# Altium schematic sheet placaTemporizadora.SchDoc
size A4
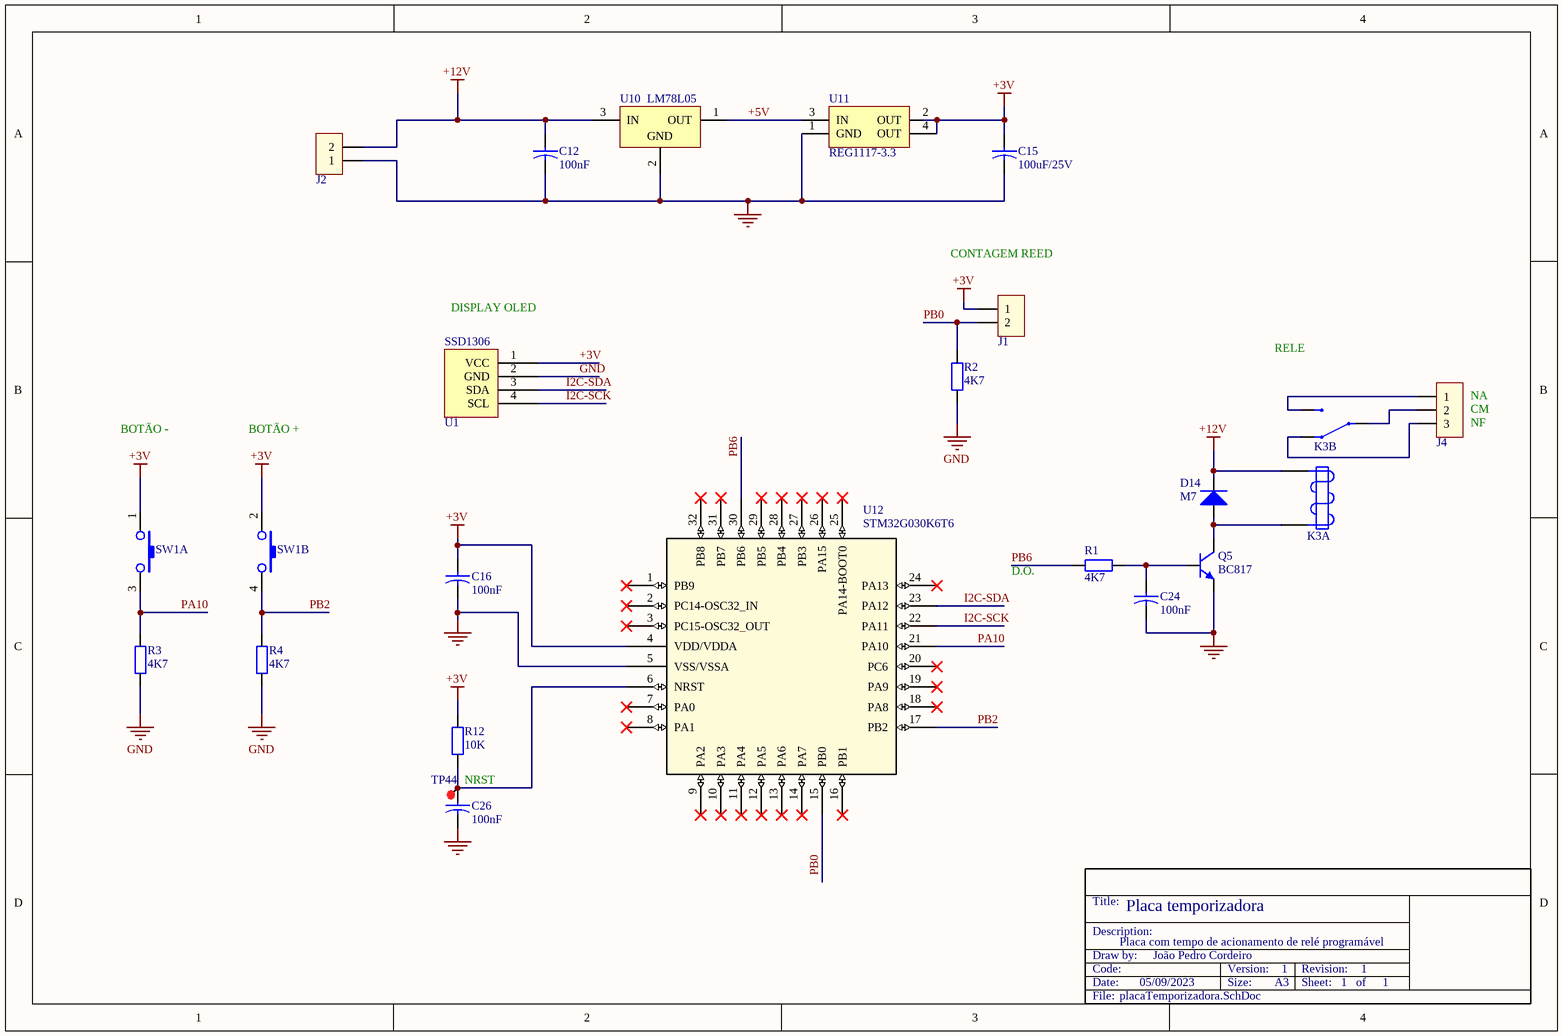
[diagram p0: placaTemporizadora.SchDoc]

## Parts
C12  100nF  [0805-CAP]
C15  100uF/25V  [CAP-POL-P3.0]
C16  100nF  [0805-CAP]
C24  100nF  [0805-CAP]
C26  100nF  [0805-CAP]
D14  M7  [SMA]
J1  BORNE  [BORNE2]  (value not drawn)
J2  BORNE  [BORNE2]  (value not drawn)
J4  BORNE  [BORNE3]  (value not drawn)
K3  RELE10A  [RELE12V_NCR]  (value not drawn)  (parts A,B of 2)
Q5  BC817  [SOT-23]
R1  4K7  [0805-RES]
R2  4K7  [0805-RES]
R3  4K7  [0805-RES]
R4  4K7  [0805-RES]
R12  10K  [0805-RES]
SW1  LT4TH243-T  [PUSHBUTTON_PTH]  (value not drawn)  (parts A,B of 2)
TP44  testepoint  [TESTPOINT]  (value not drawn)
U1  SSD1306  (value not drawn)
U10  LM78L05  [TO-92]
U11  REG1117-3.3  [SOT-223B]
U12  STM32G030K6T6  [LQFP-32]

## Nets
+3V: C15.2 C16.2 J1.1 R12.2 SW1.1 SW1.2 U1.1(VCC) U11.2(OUT) U11.4(OUT) U12.4(VDD/VDDA)
+12V: C12.2 D14.1 J2.2 K3.4 U10.3(IN)
GND: C12.1 C15.1 C16.1 C24.1 C26.1 J2.1 Q5.2(E) R2.1 R3.1 R4.1 U1.2(GND) U10.2(GND) U11.1(GND) U12.5(VSS/VSSA)
+5V: U10.1(OUT) U11.3(IN)
I2C-SCK: U1.4(SCL) U12.22(PA11)
I2C-SDA: U1.3(SDA) U12.23(PA12)
PA10: R3.2 SW1.3 U12.21(PA10)
PB0: J1.2 R2.2 U12.15(PB0)
PB2: R4.2 SW1.4 U12.17(PB2)
PB6: R1.1 U12.30(PB6)
NetC24_2: C24.2 Q5.1 R1.2
NetC26_2: C26.2 R12.1 TP44.1 U12.6(NRST)
NetD14_2: D14.2 K3.5 Q5.3(C)
NetJ4_1: J4.1 K3.3
NetJ4_2: J4.2 K3.1
NetJ4_3: J4.3 K3.2

Not connected (* = marked no-connect by the designer): U12 1(PB9)* 2(PC14-OSC32_IN)* 3(PC15-OSC32_OUT)* 7(PA0)* 8(PA1)* 9(PA2)* 10(PA3)* 11(PA4)* 12(PA5)* 13(PA6)* 14(PA7)* 16(PB1)* 18(PA8)* 19(PA9)* 20(PC6)* 24(PA13)* 25(PA14-BOOT0)* 26(PA15)* 27(PB3)* 28(PB4)* 29(PB5)* 31(PB7)* 32(PB8)*

## Notes on the sheet
- (near U1) DISPLAY OLED
- (near J1) CONTAGEM REED
- RELE
- BOTÃO -
- BOTÃO +
- (near J4) NF
- (near J4) CM
- (near J4) NA
- (near R1) D.O.
- (near TP44) NRST
- Title:
- Placa temporizadora
- Code:
- Date:
- Draw by:
- Description:
- Placa com tempo de acionamento de relé programável
- 05/09/2023
- João Pedro Cordeiro
- Size:
- Version:
- A3
- 1
- Revision:
- Sheet:        of
- File:
- INDÚSTRIAS ROSSI ELETROMECÂNICA
- Sheet:         of

## Library data of the parts
C12 C16 C24 C26 = CAP100N_0805: CAPACITOR CERAMICO 100NF (100KPF) -60V 0805 NP0 SMD; Code: 7542; Descrição: CAPACITOR CERAMICO 100NF (100KPF) -60V 0805 NP0 SMD
C15 = CAP100U_POL: CAPACITOR ELETROL. RADIAL 100UF-25V P-2.5MM X A-4MM FT; Code: 602; Descrição: CAPACITOR ELETROL. RADIAL 100UF-25V P-2.5MM X A-4MM FT
D14 = M7: DIODO M7 SMD; Code: 7556; Descrição: DIODO M7 SMD
J1 J2 = BORNE2: BORNE CI 02P COM MOLA VERDE - 112.064.13; Code: 513; Descrição: BORNE CI 02P COM MOLA VERDE - 112.064.13
J4 = BORNE3: BORNE CI 03P COM MOLA VERDE - 112.063.12; Code: 514; Descrição: BORNE CI 03P COM MOLA VERDE - 112.063.12
K3 = RELE10A: RELE ROSSI CF413012-15A OU A1022; Code: 567; Descrição: RELE ROSSI CF413012-15A OU A1022
Q5 = BC817: TRANSISTOR BC817-25 SOT-23 SMD; Code: 7540; Descrição: TRANSISTOR BC817-25 SOT-23 SMD
R1-R4 = RES4K7_0805: RESISTOR 4K7 0805 5% SMD; Code: 7505; Descrição: RESISTOR 4K7 0805 5% SMD
R12 = RES10K_0805_1: RESISTOR 10K 0805 1% SMD; Code: 6289; Descrição: RESISTOR 10K 0805 1% SMD
SW1 = PUSHBUTTON_PTH: MICRO-CHAVE TACTIL 4.3MM BASE METALICA COM SILICA-GEL LT4TH243-T  L=3.1; Code: 555; Descrição: MICRO-CHAVE TACTIL 4.3MM BASE METALICA COM SILICA-GEL LT4TH243-T  L=3.1
U1 = SSD1306: DISPLAY OLED I2C
U10 = LM78L05: CI. REGULADOR DE TENSAO 78L05 FT (TO92); Code: 551; Descrição: CI. REGULADOR DE TENSAO 78L05 FT (TO92)
U11 = REG1117-3.3: REGULADOR LDO 3.3V 800MA SOT-223 SMD; Code: 14664; ComponentLink1Description: Manufacturer Link; ComponentLink1URL: http://www.ti.com/; ComponentLink2Description: Datasheet; ComponentLink2URL: http://www-s.ti.com/sc/ds/REG1117.pdf; Descrição: REGULADOR LDO 3.3V 800MA SOT-223 SMD
U12 = STM32G030K6: CI STM32G030K6T6 ST SMD MCU ARM M0; Code: 16421; Descrição: CI STM32G030K6T6 ST SMD MCU ARM M0